# EAGLE design SD_USB (EAGLE 6.4)

## Sheet 1 of 3: ALFAT
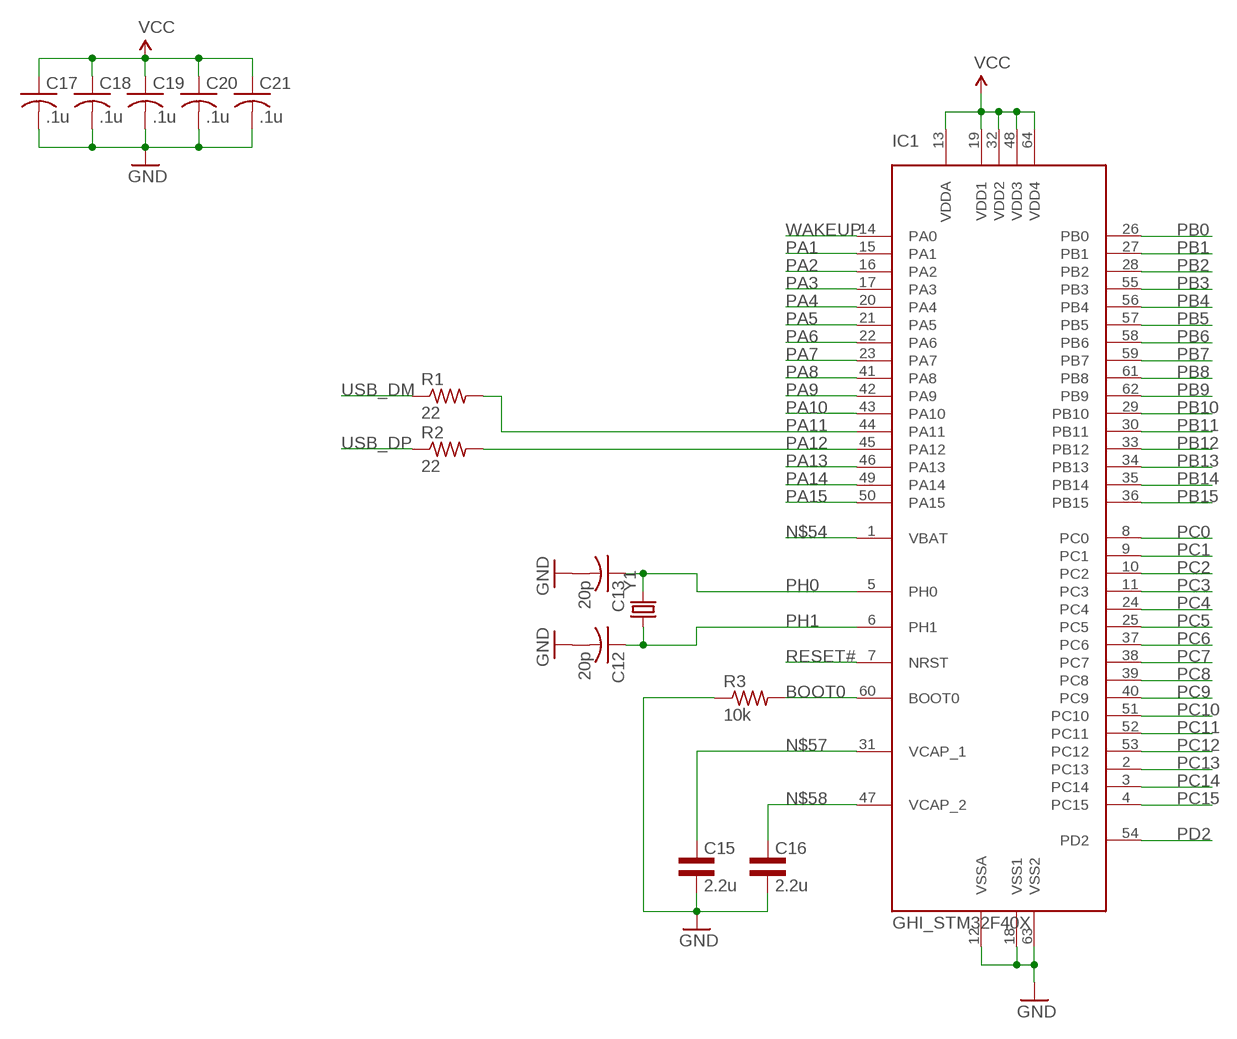
[diagram p0: schematic, sheet 1]

### Parts
C12  20p  C-USC0603  [C0603]
C13  20p  C-USC0603  [C0603]
C15  2.2u  CAP0805L3  [0805L3]
C16  2.2u  CAP0805L3  [0805L3]
C17  .1u  C-USC0603  [C0603]
C18  .1u  C-USC0603  [C0603]
C19  .1u  C-USC0603  [C0603]
C20  .1u  C-USC0603  [C0603]
C21  .1u  C-USC0603  [C0603]
IC1  GHI_STM32F40X  [GHI_LQFP64]
R1  22  R-US_R0603  [R0603]
R2  22  R-US_R0603  [R0603]
R3  10k  R-US_R0603  [R0603]
Y1  CRYSTALHC49US  [HC49US]

### Nets
BOOT0: IC1.60(BOOT0) R3.2
GND: C12.2 C13.2 C15.2 C16.2 C17.2 C18.2 C19.2 C20.2 C21.2 IC1.12(VSSA) IC1.18(VSS1) IC1.63(VSS2) R3.1
N$54: IC1.1(VBAT)
N$57: C15.1 IC1.31(VCAP_1)
N$58: C16.1 IC1.47(VCAP_2)
PA1: IC1.15(PA1)
PA2: IC1.16(PA2)
PA3: IC1.17(PA3) ; also sheet 2
PA4: IC1.20(PA4)
PA5: IC1.21(PA5) ; also sheet 2
PA6: IC1.22(PA6)
PA7: IC1.23(PA7)
PA8: IC1.41(PA8) ; also sheet 2
PA9: IC1.42(PA9)
PA10: IC1.43(PA10)
PA11: IC1.44(PA11) R1.2
PA12: IC1.45(PA12) R2.2
PA13: IC1.46(PA13)
PA14: IC1.49(PA14)
PA15: IC1.50(PA15)
PB0: IC1.26(PB0) ; also sheet 2
PB1: IC1.27(PB1) ; also sheet 2
PB2: IC1.28(PB2)
PB3: IC1.55(PB3)
PB4: IC1.56(PB4)
PB5: IC1.57(PB5) ; also sheet 2
PB6: IC1.58(PB6)
PB7: IC1.59(PB7)
PB8: IC1.61(PB8)
PB9: IC1.62(PB9)
PB10: IC1.29(PB10) ; also sheet 2
PB11: IC1.30(PB11) ; also sheet 2
PB12: IC1.33(PB12) ; also sheet 2
PB13: IC1.34(PB13) ; also sheet 2
PB14: IC1.35(PB14)
PB15: IC1.36(PB15)
PC0: IC1.8(PC0) ; also sheet 2
PC1: IC1.9(PC1)
PC2: IC1.10(PC2) ; also sheet 2
PC3: IC1.11(PC3) ; also sheet 2
PC4: IC1.24(PC4) ; also sheet 3
PC5: IC1.25(PC5) ; also sheet 3
PC6: IC1.37(PC6)
PC7: IC1.38(PC7)
PC8: IC1.39(PC8) ; also sheet 3
PC9: IC1.40(PC9) ; also sheet 3
PC10: IC1.51(PC10) ; also sheet 3
PC11: IC1.52(PC11) ; also sheet 3
PC12: IC1.53(PC12) ; also sheet 3
PC13: IC1.2(PC13)
PC14: IC1.3(PC14)
PC15: IC1.4(PC15)
PD2: IC1.54(PD2) ; also sheet 3
PH0: C13.1 IC1.5(PH0) Y1.2
PH1: C12.1 IC1.6(PH1) Y1.1
RESET#: IC1.7(NRST)
USB_DM: R1.1 ; also sheet 3
USB_DP: R2.1 ; also sheet 3
VCC: C17.1 C18.1 C19.1 C20.1 C21.1 IC1.13(VDDA) IC1.19(VDD1) IC1.32(VDD2) IC1.48(VDD3) IC1.64(VDD4)
WAKEUP: IC1.14(PA0)

## Sheet 2 of 3: HS PHY
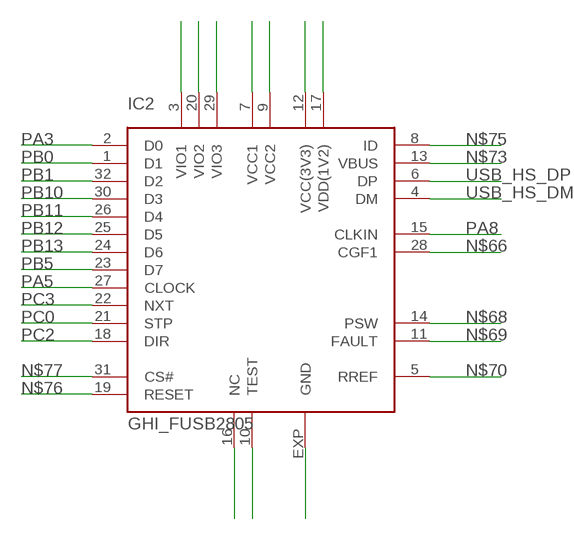
[diagram p1: schematic, sheet 2]

### Parts
IC2  GHI_FUSB2805  [GHI_MLP32]

### Nets
N$66: IC2.28(CGF1)
N$68: IC2.14(PSW)
N$69: IC2.11(FAULT)
N$70: IC2.5(RREF)
N$73: IC2.13(VBUS)
N$75: IC2.8(ID)
N$76: IC2.19(RESET)
N$77: IC2.31(CS#)
N$90: IC2.3(VIO1)
N$91: IC2.20(VIO2)
N$92: IC2.29(VIO3)
N$93: IC2.7(VCC1)
N$94: IC2.16(NC)
N$95: IC2.10(TEST)
N$96: IC2.EXP(GND)
N$97: IC2.9(VCC2)
N$98: IC2.12(VCC(3V3))
N$99: IC2.17(VDD(1V2))
PA3: IC2.2(D0) ; also sheet 1
PA5: IC2.27(CLOCK) ; also sheet 1
PA8: IC2.15(CLKIN) ; also sheet 1
PB0: IC2.1(D1) ; also sheet 1
PB1: IC2.32(D2) ; also sheet 1
PB5: IC2.23(D7) ; also sheet 1
PB10: IC2.30(D3) ; also sheet 1
PB11: IC2.26(D4) ; also sheet 1
PB12: IC2.25(D5) ; also sheet 1
PB13: IC2.24(D6) ; also sheet 1
PC0: IC2.21(STP) ; also sheet 1
PC2: IC2.18(DIR) ; also sheet 1
PC3: IC2.22(NXT) ; also sheet 1
USB_HS_DM: IC2.4(DM) ; also sheet 3
USB_HS_DP: IC2.6(DP) ; also sheet 3

## Sheet 3 of 3: Connectors
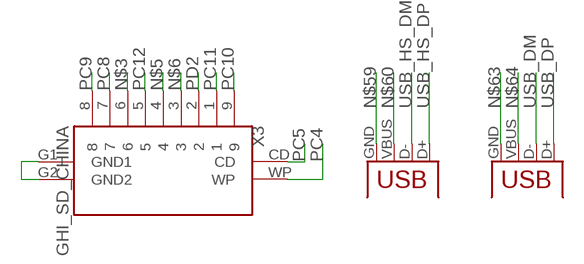
[diagram p2: schematic, sheet 3]

### Parts
X1  USB-A-H  [USB-A-H]
X2  USB-A-H  [USB-A-H]
X3  GHI_SD_CHINA  [GHI_SD_CHINA]

### Nets
N$3: X3.6
N$5: X3.4
N$6: X3.3
N$12: X3.G1(GND1) X3.G2(GND2)
N$59: X1.GND
N$60: X1.VBUS
N$63: X2.GND
N$64: X2.VBUS
PC4: X3.WP ; also sheet 1
PC5: X3.CD ; also sheet 1
PC8: X3.7 ; also sheet 1
PC9: X3.8 ; also sheet 1
PC10: X3.9 ; also sheet 1
PC11: X3.1 ; also sheet 1
PC12: X3.5 ; also sheet 1
PD2: X3.2 ; also sheet 1
USB_DM: X2.D- ; also sheet 1
USB_DP: X2.D+ ; also sheet 1
USB_HS_DM: X1.D- ; also sheet 2
USB_HS_DP: X1.D+ ; also sheet 2

## Library data of the parts
C12 C13 C17-C21 = rcl-2:C-US: CAPACITOR, American symbol
C15 C16 = common:CAP
IC1 = ALFAT_Lib:GHI_STM32F40X
IC2 = ALFAT_Lib:GHI_FUSB2805
R1-R3 = rcl:R-US_: RESISTOR, American symbol
X1 X2 = con-usb:USB: USB Connectors
X3 = ALFAT_Lib:GHI_SD_CHINA
Y1 = SparkFun-FreqCtrl:CRYSTAL: Various standard crystals. Proven footprints. Spark Fun Electronics SKU : COM-00534

## Board
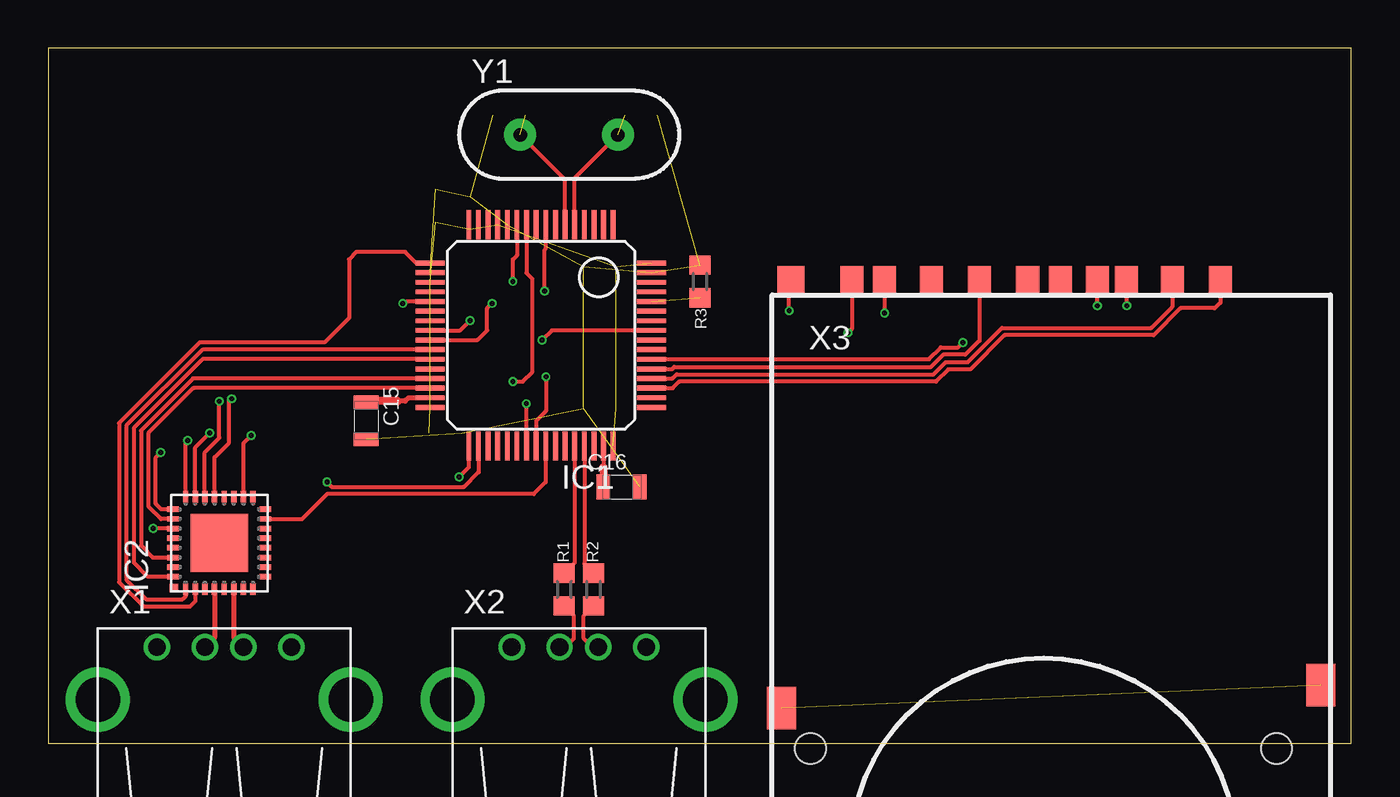
[diagram p3: board, top side]
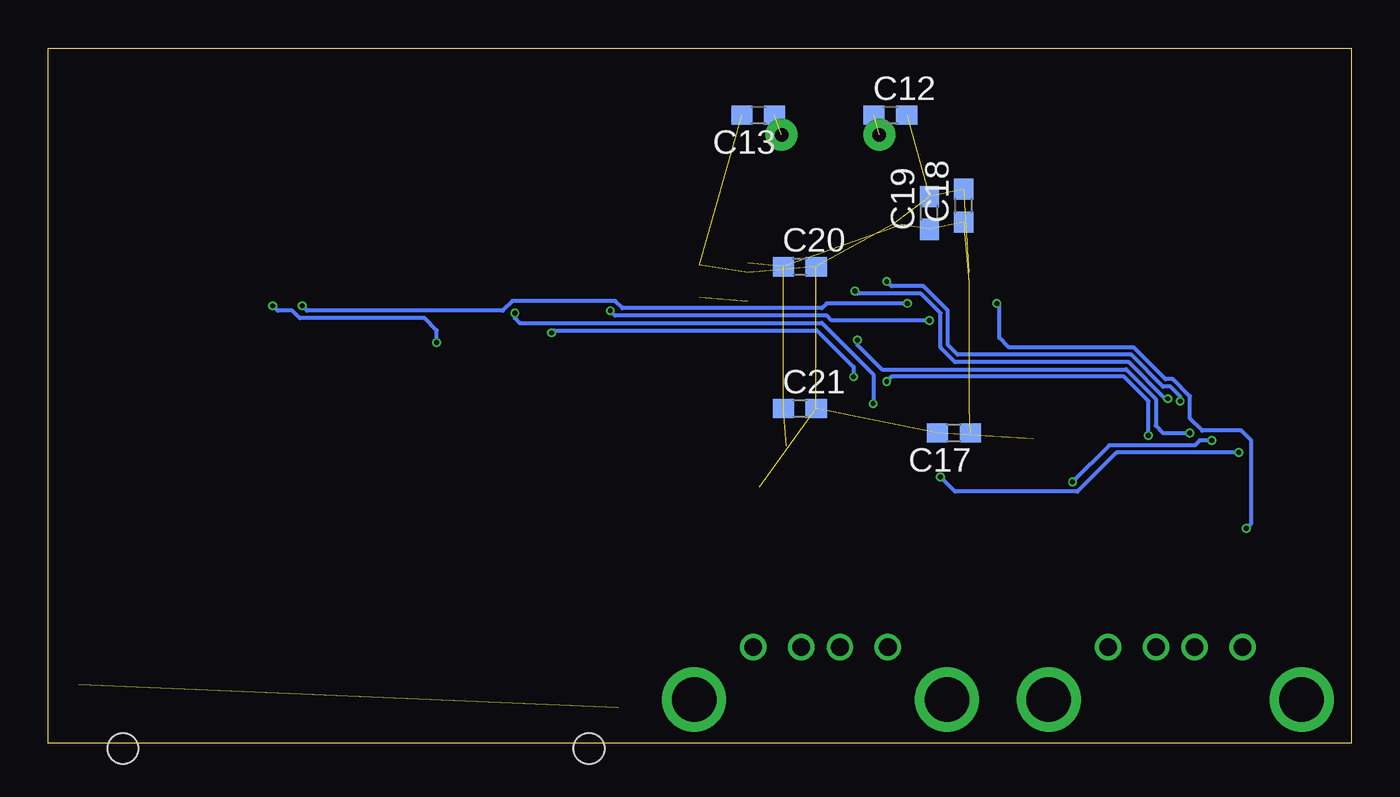
[diagram p4: board, bottom side, seen from below]

Size 67.67 x 36.12 mm. Coordinates in mm from the lower left corner, seen from the top.
Outline: 0,0 67.67,0 67.67,36.12 0,36.12 0,0
Copper layers (1*2*3*16): Top 0.035mm / dielectric 1.5mm / Route2 0.035mm / dielectric 0.15mm / Route3 0.035mm / dielectric 0.2mm / Bottom 0.035mm
Design rules "default *": minimum track width 10mil, minimum drill 24mil, track to track 8mil, track to pad 8mil, pad to pad 8mil, via to via 8mil, smd to smd 8mil, copper to edge 40mil, drill to drill 8mil, minimum pad ring 4mil, minimum via ring 4mil, stop-mask expansion 4mil, vias tented up to drill 0mil, thermal gap 10mil

### Footprints (pad centres in the part's own frame; a part is rotated, then mirrored left to right if it is on the bottom)
C0603 = smd 1.1 x 1: 1 -0.85,0; 2 0.85,0
0805L3 = smd 0.7 x 1.3: 1 -0.95,0; 2 0.95,0
GHI_LQFP64 = smd 0.25 x 1.5: 1 -3.75,-5.75; 2 -3.25,-5.75; 3 -2.75,-5.75; 4 -2.25,-5.75; 5 -1.75,-5.75; 6 -1.25,-5.75; 7 -0.75,-5.75; 8 -0.25,-5.75; 9 0.25,-5.75; 10 0.75,-5.75; 11 1.25,-5.75; 12 1.75,-5.75; 13 2.25,-5.75; 14 2.75,-5.75; 15 3.25,-5.75; 16 3.75,-5.75; 33 3.75,5.75; 34 3.25,5.75; 35 2.75,5.75; 36 2.25,5.75; 37 1.75,5.75; 38 1.25,5.75; 39 0.75,5.75; 40 0.25,5.75; 41 -0.25,5.75; 42 -0.75,5.75; 43 -1.25,5.75; 44 -1.75,5.75; 45 -2.25,5.75; 46 -2.75,5.75; 47 -3.25,5.75; 48 -3.75,5.75 | smd 1.5 x 0.25: 17 5.75,-3.75; 18 5.75,-3.25; 19 5.75,-2.75; 20 5.75,-2.25; 21 5.75,-1.75; 22 5.75,-1.25; 23 5.75,-0.75; 24 5.75,-0.25; 25 5.75,0.25; 26 5.75,0.75; 27 5.75,1.25; 28 5.75,1.75; 29 5.75,2.25; 30 5.75,2.75; 31 5.75,3.25; 32 5.75,3.75; 49 -5.75,3.75; 50 -5.75,3.25; 51 -5.75,2.75; 52 -5.75,2.25; 53 -5.75,1.75; 54 -5.75,1.25; 55 -5.75,0.75; 56 -5.75,0.25; 57 -5.75,-0.25; 58 -5.75,-0.75; 59 -5.75,-1.25; 60 -5.75,-1.75; 61 -5.75,-2.25; 62 -5.75,-2.75; 63 -5.75,-3.25; 64 -5.75,-3.75
GHI_MLP32 = smd 0.6 x 0.28: 1 -2.4,1.75; 2 -2.4,1.25; 3 -2.4,0.75; 4 -2.4,0.25; 5 -2.4,-0.25; 6 -2.4,-0.75; 7 -2.4,-1.25; 8 -2.4,-1.75; 17 2.4,-1.75; 18 2.4,-1.25; 19 2.4,-0.75; 20 2.4,-0.25; 21 2.4,0.25; 22 2.4,0.75; 23 2.4,1.25; 24 2.4,1.75 | smd 0.28 x 0.6: 9 -1.75,-2.4; 10 -1.25,-2.4; 11 -0.75,-2.4; 12 -0.25,-2.4; 13 0.25,-2.4; 14 0.75,-2.4; 15 1.25,-2.4; 16 1.75,-2.4; 25 1.75,2.4; 26 1.25,2.4; 27 0.75,2.4; 28 0.25,2.4; 29 -0.25,2.4; 30 -0.75,2.4; 31 -1.25,2.4; 32 -1.75,2.4 | smd 3 x 3: EXP 0,0 | smd 0.435 x 0.435: M -2.353,2.353
R0603 = smd 1 x 1.1: 1 -0.85,0; 2 0.85,0
USB-A-H = drill 0.914: D+ 2.718,-1.003; D- 2.718,1.003; GND 2.718,-3.493; VBUS 2.718,3.493 | drill 2.311: P$5 0,-6.566; P$6 0,6.566
GHI_SD_CHINA = smd 1.2 x 1.5: 1 6.68,24.31; 2 4.307,24.31; 3 0.88,24.31; 4 -0.83,24.31; 5 -3.33,24.31; 6 -5.83,24.31; 7 -8.26,24.31; 8 -9.96,24.31; 9 9.18,24.31; CD 2.784,24.31 | smd 1.5 x 2.2: G1 -13.6,2.1; G2 14.4,3.3 | smd 1.4 x 1.5: WP -13.11,24.31 | hole 1.6: -12.1,0; 12.1,0
HC49US = drill 0.7 pad 1.651: 1 -2.54,0; 2 2.54,0

### Placement (x,y rotation side)
C12  23.94,32.64 0 bottom
C13  30.8,32.64 180 bottom
C15  16.51,16.76 270 top
C16  29.78,13.33 0 top
C17  20.64,16.13 180 bottom
C18  20.13,27.94 90 bottom
C19  21.91,27.56 90 bottom
C20  28.64,24.77 0 bottom
C21  28.64,17.4 0 bottom
IC1  25.59,21.21 180 top
IC2  8.89,10.41 90 top
R1  26.8,8 90 top
R2  28.32,8 90 top
R3  33.85,24 270 top
X1  9.14,2.29 90 top
X2  27.56,2.29 90 top
X3  51.69,-0.25 0 top
Y1  27.05,31.62 0 top

### Tracks (layer width: path | path; a pad name or v marks a point on that pad's centre or on a via)
BOOT0  (1 unrouted)
GND  (12 unrouted)
N$12  (1 unrouted)
N$57
  Top 0.254: IC1.31 18.72,17.96 18.54,17.78 18.16,17.78
  Top 0.406: 18.16,17.78 16.58,17.78 C15.1
N$58
  Top 0.203: IC1.47 28.84,14.36 28.83,14.35
  Top 0.406: 28.83,14.35 C16.1
PA3
  Top 0.203: IC1.17 19.11,24.96 18.54,25.53 16,25.53 15.62,25.15 15.62,22.1 14.35,20.83 7.87,20.83 3.68,16.64 3.68,8.38 4.95,7.11 7.37,7.11 7.64,7.39 IC2.2
PA5  (via drill 0.25)
  Top 0.203: IC2.27 5.47,11.16 v5.46,11.18 | v18.42,22.86 18.54,22.86 18.64,22.96 IC1.21
  Bottom 0.203: v5.46,11.18 5.21,11.43 5.21,15.75 5.72,16.26 7.75,16.26 8.38,16.89 8.38,18.03 9.27,18.92 9.65,18.92 11.3,20.57 17.78,20.57 18.29,21.08 18.29,22.73 v18.42,22.86
PA8
  Top 0.203: IC1.41 25.84,13.58 25.21,12.95 14.48,12.95 13.19,11.66 IC2.15 11.31,11.68
PA11
  Top 0.203: IC1.44 27.34,9.39 R1.2
PA12
  Top 0.203: IC1.45 27.84,9.33 R2.2
PB0
  Top 0.203: IC1.26 8.01,20.46 4.06,16.51 4.06,8.51 5.08,7.49 6.98,7.49 7.14,7.65 IC2.1
PB1
  Top 0.203: IC1.27 8.02,19.96 4.45,16.38 4.45,9.4 5.18,8.66 IC2.32
PB5  (via drill 0.25)
  Top 0.203: IC2.23 7.64,15.39 v8.38,16.13 | IC1.57 26.16,21.46 v25.65,20.95
  Bottom 0.203: v25.65,20.95 25.65,20.7 24.38,19.43 11.68,19.43 10.16,17.91 10.16,16.51 9.78,16.13 v8.38,16.13
PB10
  Top 0.203: IC1.29 7.53,18.96 4.83,16.26 4.83,10.29 5.46,9.65 IC2.30
PB11
  Top 0.203: IC1.30 7.54,18.46 5.21,16.13 5.21,12.32 5.86,11.66 IC2.26
PB12  (via drill 0.25)
  Top 0.203: IC2.25 5.87,12.16 5.59,12.45 5.59,14.86 v5.84,15.11 | v21.34,13.84 21.84,14.35 IC1.33
  Bottom 0.203: v5.84,15.11 12.19,15.11 14.22,13.08 20.57,13.08 v21.34,13.84
PB13  (via drill 0.25)
  Top 0.203: IC2.24 7.14,15.65 v7.24,15.75 | v14.48,13.59 14.73,13.33 21.59,13.33 22.35,14.1 22.34,14.11 IC1.34
  Bottom 0.203: v7.24,15.75 7.87,15.75 8.13,15.49 12.57,15.49 v14.48,13.59
PC0  (via drill 0.25)
  Top 0.203: IC2.21 8.64,14.86 9.4,15.62 9.4,17.78 v9.53,17.91 | IC1.8 25.84,25.71 25.78,25.65 v25.78,23.49
  Bottom 0.203: v9.53,17.91 9.65,17.91 11.56,19.81 20.57,19.81 21.34,20.57 21.34,22.35 22.35,23.37 25.65,23.37 v25.78,23.49
PC2  (via drill 0.25)
  Top 0.203: IC1.10 24.84,24.44 25.15,24.13 25.15,19.3 24.64,18.8 v24.13,18.8 | IC2.18 10.14,15.6 v10.54,16
  Bottom 0.203: v10.54,16 10.54,17.78 11.81,19.05 23.88,19.05 v24.13,18.8
PC3  (via drill 0.25)
  Top 0.203: IC2.22 8.14,15.12 8.89,15.88 v8.89,17.78 | IC1.11 24.34,25.36 24.13,25.15 v24.13,24
  Bottom 0.203: v8.89,17.78 8.89,18.03 9.4,18.54 9.78,18.54 11.43,20.19 20.45,20.19 20.96,20.7 20.96,22.48 22.23,23.75 23.88,23.75 v24.13,24
PC4  (via drill 0.25)
  Top 0.203: IC1.24 21.4,21.46 v21.91,21.97 | v38.48,22.48 38.48,23.96 X3.WP
  Bottom 0.203: v21.91,21.97 26.99,21.97 27.24,22.22 38.23,22.22 v38.48,22.48
PC5  (via drill 0.25)
  Top 0.203: IC1.25 22.29,20.96 22.8,21.46 22.8,22.61 v23.05,22.86 | v54.48,22.73 54.48,24.05 X3.CD
  Bottom 0.203: v23.05,22.86 27.24,22.86 27.5,22.61 37.85,22.61 38.23,22.99 43.56,22.99 44.07,22.48 54.23,22.48 v54.48,22.73
PC8  (via drill 0.25)
  Top 0.203: v24.83,17.65 24.83,15.47 IC1.39 | X3.7 v43.43,22.36 v43.43,22.35
  Bottom 0.203: v24.83,17.65 24.83,19.18 27.5,21.84 43.18,21.84 43.43,22.1 v43.43,22.35
PC9  (via drill 0.25)
  Top 0.203: X3.8 41.73,21.54 v41.53,21.34 | v25.85,19.05 25.85,17.27 25.34,16.76 IC1.40
  Bottom 0.203: v41.53,21.34 41.4,21.46 27.75,21.46 25.85,19.56 v25.85,19.05
PC10
  Top 0.203: X3.9 60.87,22.9 60.58,22.61 58.8,22.61 57.4,21.21 49.66,21.21 47.88,19.43 46.74,19.43 46.1,18.8 32.77,18.8 32.43,18.46 IC1.51
PC11
  Top 0.203: 58.42,24 X3.1 58.37,22.68 57.28,21.59 49.53,21.59 47.75,19.81 46.61,19.81 45.97,19.18 32.64,19.18 32.42,18.96 IC1.52
PC12
  Top 0.203: IC1.53 32.41,19.46 32.51,19.56 45.85,19.56 46.48,20.19 47.62,20.19 48.36,20.93 X3.5
PD2  (via drill 0.25)
  Top 0.203: IC1.54 45.74,19.96 46.36,20.57 47.24,20.57 v47.5,20.83 | v56.01,22.73 56.01,24.05 X3.2
  Bottom 0.203: v47.5,20.83 47.5,21.46 48.13,22.1 54.61,22.1 54.99,22.48 55.75,22.48 v56.01,22.73
PH0  (1 unrouted)
  Top 0.203: IC1.5 27.34,29.37 Y1.2
PH1  (1 unrouted)
  Top 0.203: IC1.6 26.84,29.29 Y1.1
USB_DM
  Top 0.203: X2.D- 26.85,5 27.3,5.46 27.3,6.64 R1.1
USB_DP
  Top 0.203: X2.D+ 28.27,5 27.81,5.46 27.81,6.64 R2.1
USB_HS_DM
  Top 0.254: IC2.4 8.64,5.5 X1.D-
USB_HS_DP
  Top 0.254: IC2.6 9.64,5.51 X1.D+
VCC  (9 unrouted)